# Altium schematic sheet Project_overview.SchDoc
size 420 x 297 mm; SheetNumber: 1; SheetTotal: 8
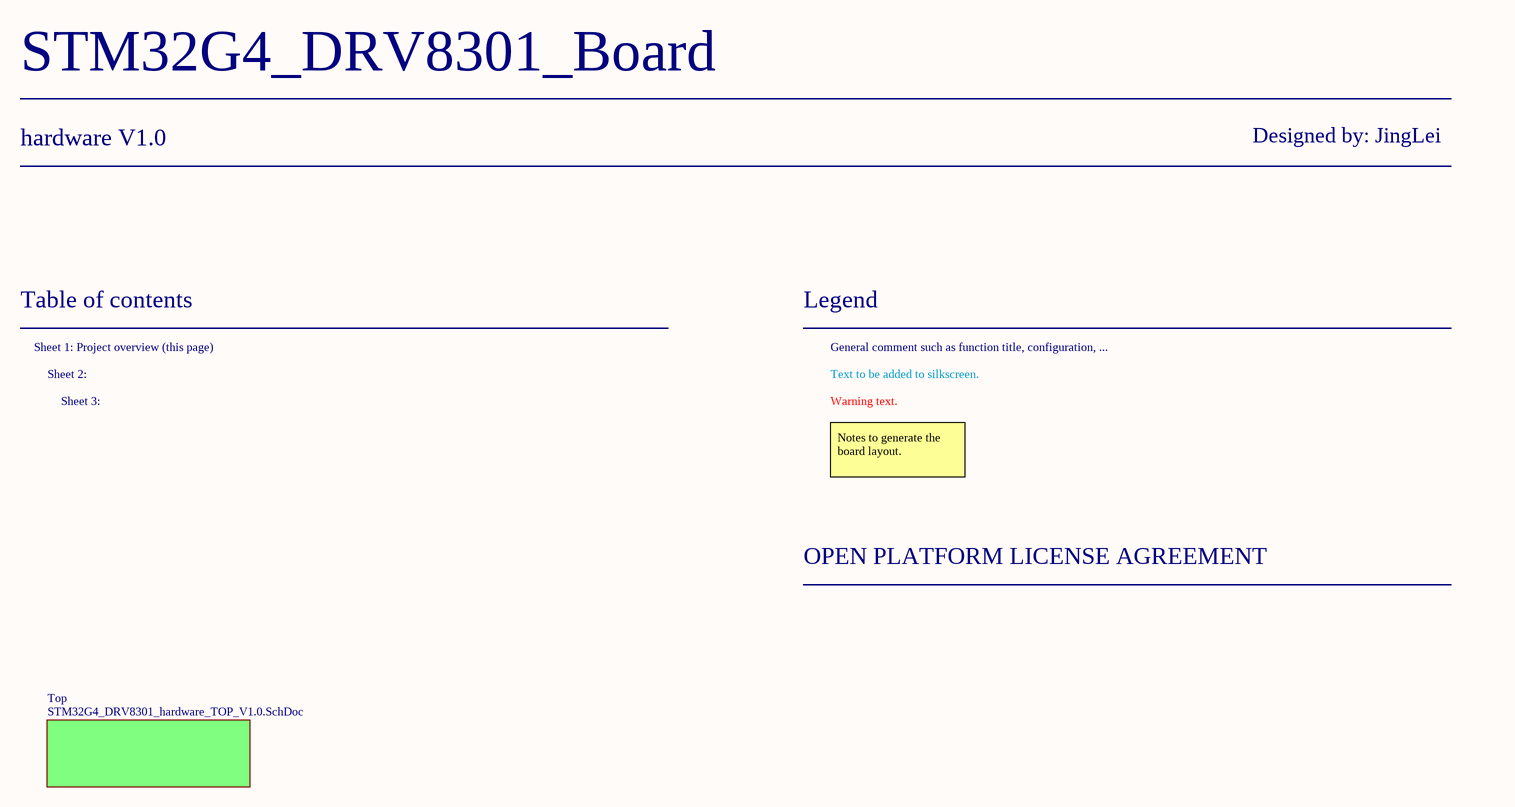
[diagram p0: Project_overview.SchDoc]

## Sub-sheets
Top = STM32G4_DRV8301_hardware_TOP_V1.0.SchDoc: no entries

## Notes on the sheet
- STM32G4_DRV8301_Board
- hardware V1.0
- Designed by: JingLei
- Table of contents
- Sheet 1: Project overview (this page)
- Legend
- General comment such as function title, configuration, ...
- Sheet 2:
- Sheet 3:
- Text to be added to silkscreen.
- Warning text.
- Notes to generate the board layout.
- OPEN PLATFORM LICENSE AGREEMENT
- THIS DOCUMENT AND THE DATA DISCLOSED HEREIN OR
- HEREWITH IS THE PROPERTY OF ALTIUM LIMITED AND MAY
- DWG NO:
- REVISION
- REV:
- DESCRIPTION
- DATE
- APPROVED
- BE FREELY DISTRIBUTED IN WHOLE. NO RIGHTS ARE
- RESERVED OR EXPRESS OR IMPLIED WARANTEE GIVEN.
- ENG:
- APPROVALS
- PROJECT
- DSN:
- CHK:
- REFERENCE DOCUMENTS
- PROJECT REVISION:
- TITLE
- DOCUMENT REVISION:
- DESIGN ITEM:
- BOM:
- FAB DWG:
- PCB DWG:
- ASSY DWG:
- SCALE:
- A3
- SIZE
- CAGE CODE
- FILE NAME
- DWG NO.
- SHEET
- OF
- REV